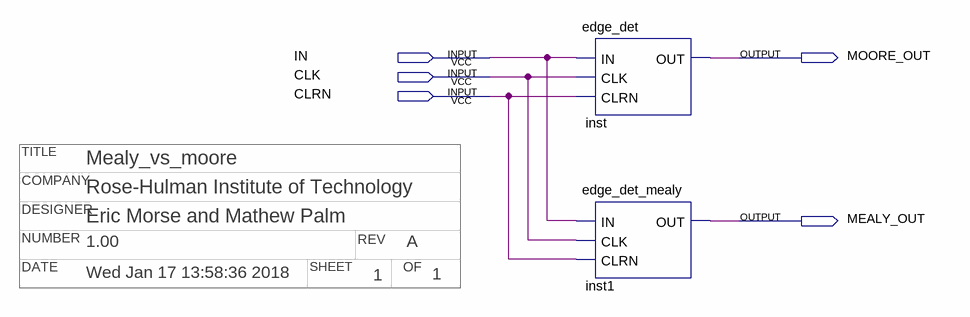
[diagram p0: schematic sheet]
// Quartus schematic mealy_vs_moore.bdf as structural Verilog: 2 symbols, 5 pins
// Title block: COMPANY: Rose-Hulman Institute of Technology; DATE: Wed Jan 17 13:58:36 2018; DESIGNER: Eric Morse and Mathew Palm; NUMBER: 1.00; OF: 1; REV: A; SHEET: 1; TITLE: Mealy_vs_moore
module mealy_vs_moore (
  input  IN,
  input  CLK,
  input  CLRN,
  output MOORE_OUT,
  output MEALY_OUT
);

  edge_det inst (.IN(IN), .CLK(CLK), .CLRN(CLRN), .OUT(MOORE_OUT));
  edge_det_mealy inst1 (.IN(IN), .CLK(CLK), .CLRN(CLRN), .OUT(MEALY_OUT));
endmodule
